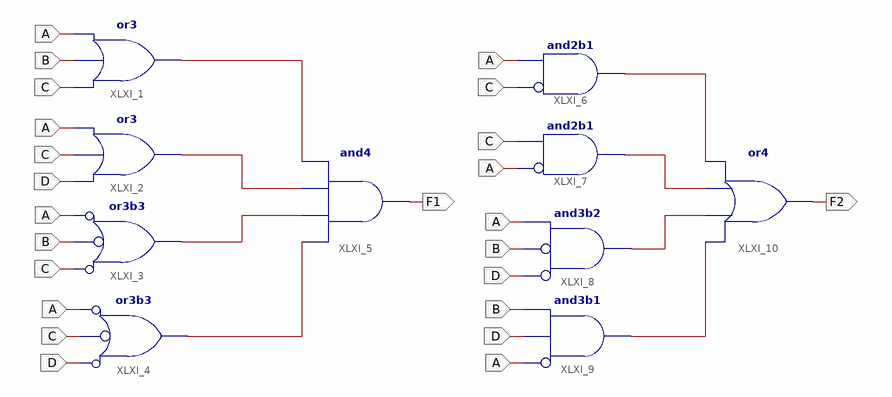
[diagram p0: schematic sheet 1]
// Xilinx ISE schematic Lab_2_2.sch (spartan3e) as structural Verilog: 10 symbols, 6 ports
module Lab_2_2 (
  input  A,
  input  C,
  input  D,
  input  B,
  output F1,
  output F2
);

  wire XLXN_1, XLXN_2, XLXN_3, XLXN_4, XLXN_18, XLXN_19, XLXN_20, XLXN_21;

  or XLXI_1 (XLXN_1, C, B, A);
  or XLXI_2 (XLXN_2, D, C, A);
  or XLXI_3 (XLXN_3, ~C, ~B, ~A);  // or3b3
  or XLXI_4 (XLXN_4, ~D, ~C, ~A);  // or3b3
  and XLXI_5 (F1, XLXN_4, XLXN_3, XLXN_2, XLXN_1);
  and XLXI_6 (XLXN_18, ~C, A);  // and2b1
  and XLXI_7 (XLXN_19, ~A, C);  // and2b1
  and XLXI_8 (XLXN_20, ~D, ~B, A);  // and3b2
  and XLXI_9 (XLXN_21, ~A, D, B);  // and3b1
  or XLXI_10 (F2, XLXN_21, XLXN_20, XLXN_19, XLXN_18);
endmodule
